# EAGLE design Router32PA v1 (EAGLE 9.5.0)
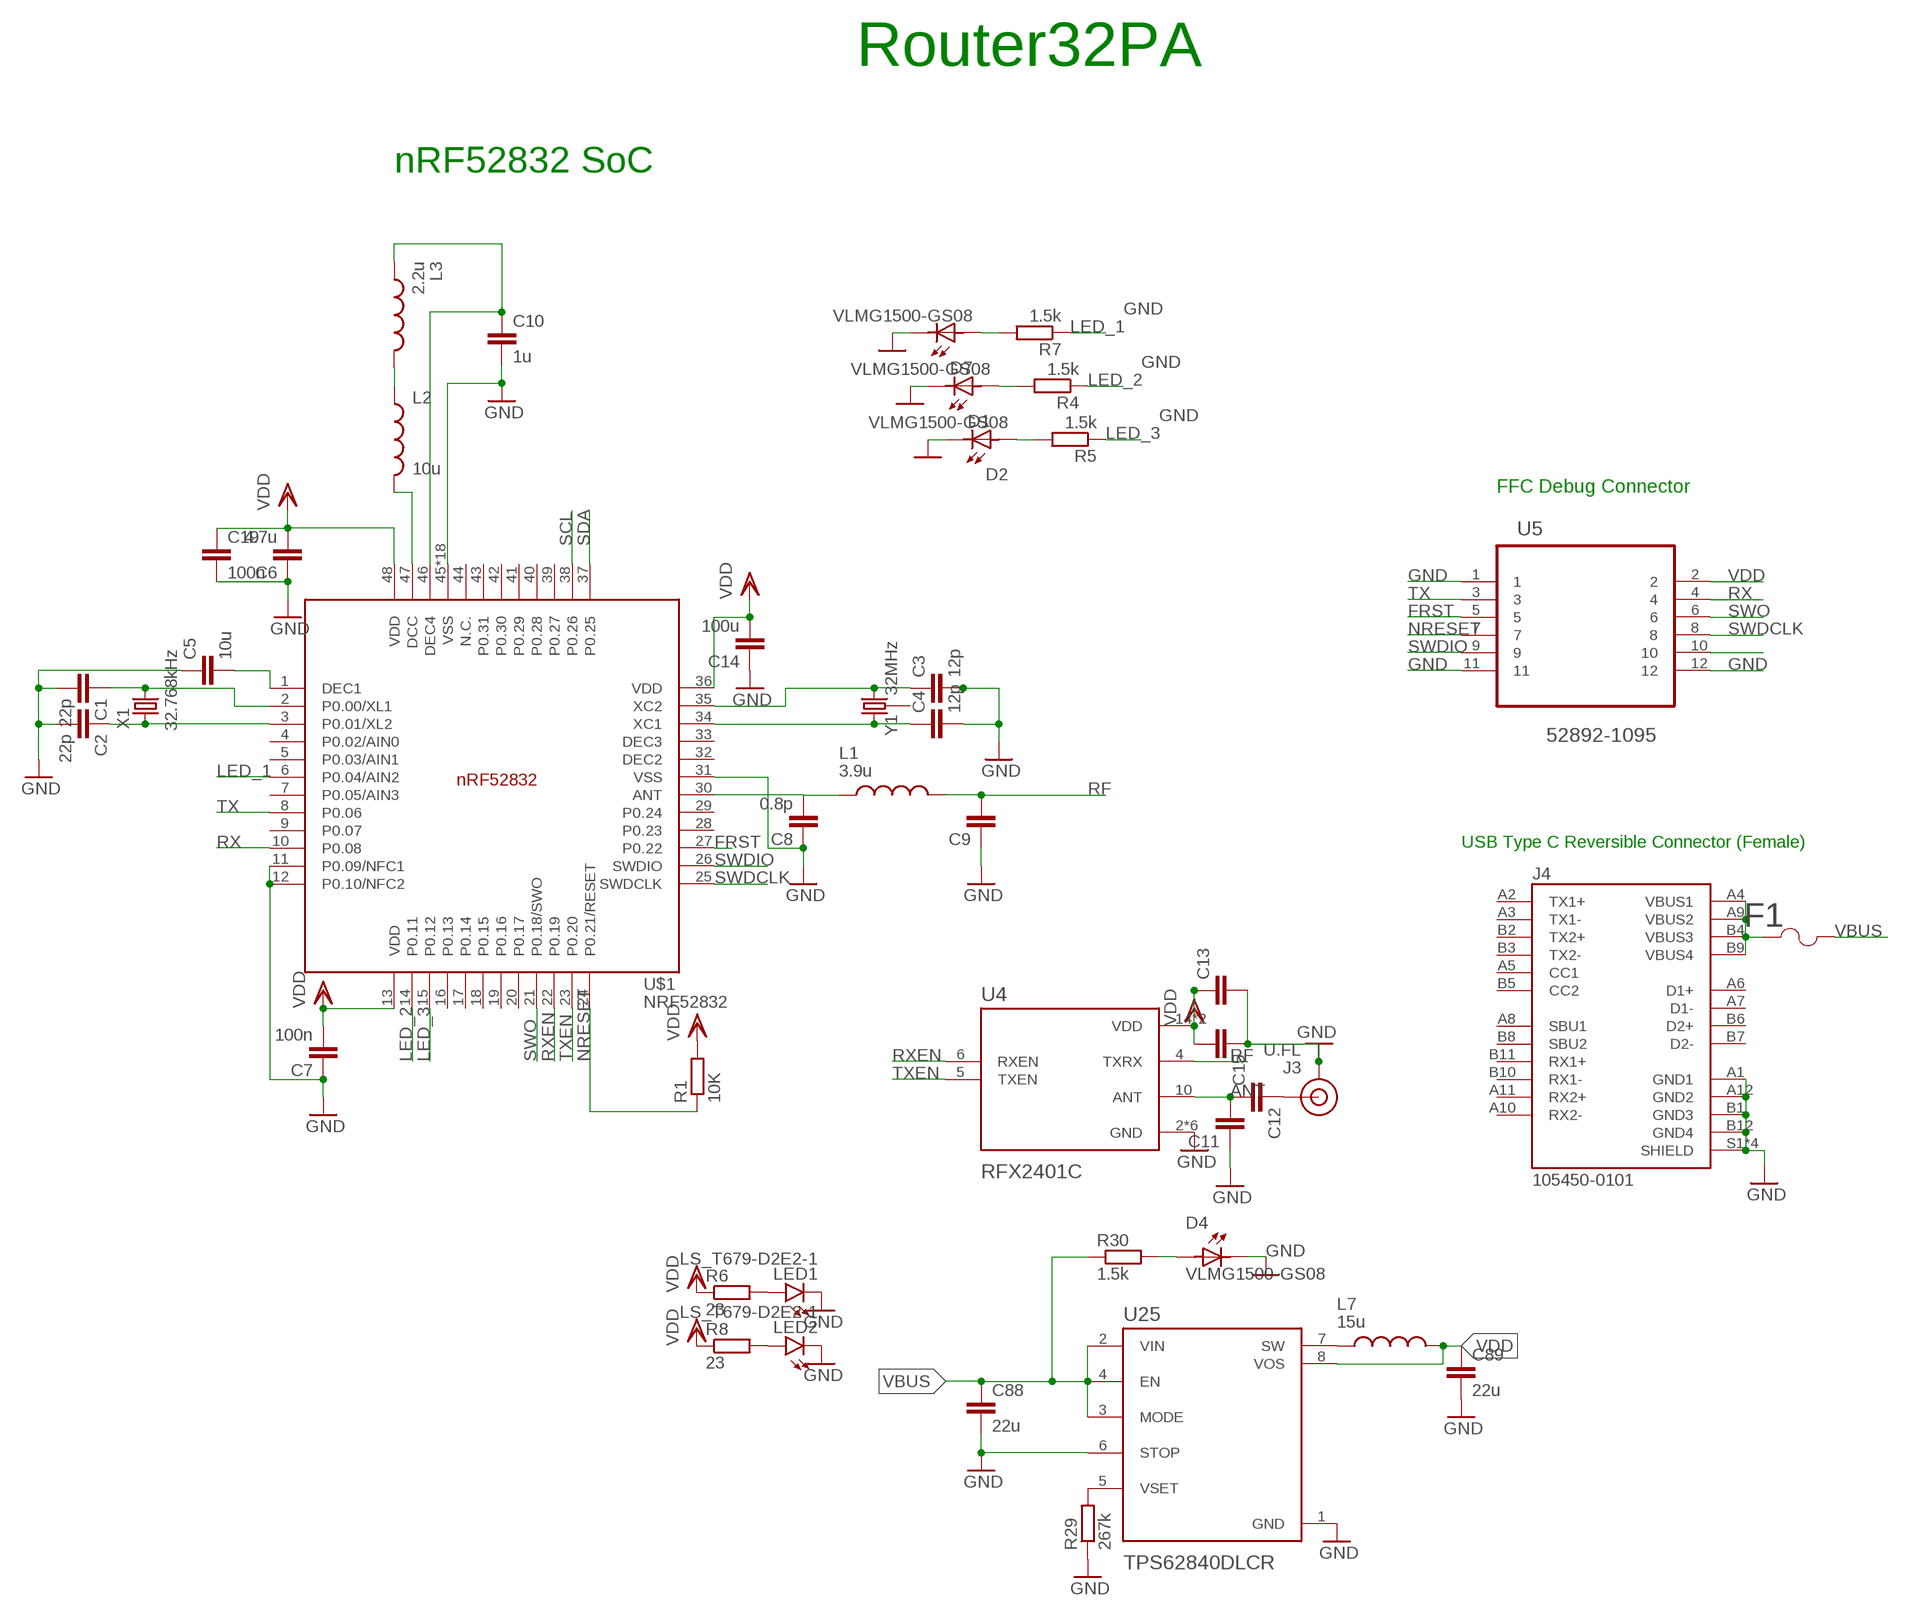
[diagram p0: schematic, sheet 1]

## Parts
C1  22p  CC0402  [C0402]
C2  22p  CC0402  [C0402]
C3  12p  CC0402  [C0402]
C4  12p  CC0402  [C0402]
C5  10u  CC0402  [C0402]
C6  4.7u  CC0402  [C0402]
C7  100n  CC0603R  [C0603R]
C8  0.8p  CC0402  [C0402]
C9  1.2p  CC0402  [C0402]
C10  1u  CC0402  [C0402]
C11  1.2p  CC0402  [C0402]
C12  1.2p  CC0402  [C0402]
C13  1.2p  CC0402  [C0402]
C14  100u  CC0402  [C0402]
C15  1.2p  CC0402  [C0402]
C19  100n  CC0402  [C0402]
C88  22u  CC0603R  [C0603R]
C89  22u  CC0603R  [C0603R]
D1  VLMG1500-GS08  [LEDC1005X35N]
D2  VLMG1500-GS08  [LEDC1005X35N]
D4  VLMG1500-GS08  [LEDC1005X35N]
D7  VLMG1500-GS08  [LEDC1005X35N]
F1  1210L050YR1210LSERIES_LTF-L  [1210LSERIES_LTF-L]
J3  U.FL  U.FL2PIN  [U.FL]
J4  105450-0101  [MOLEX_105450-0101]
L1  3.9u  MHQ0402P7N5JT000  [INDC0402X26N]
L2  10u  INDUCTOR  [L0603]
L3  2.2u  MHQ0402P7N5JT000  [INDC0402X26N]
L7  15u  1277AS-H-1R5M=P2  [INDC3225X120N]
LED1  LS_T679-D2E2-1  [PLCC2]
LED2  LS_T679-D2E2-1  [PLCC2]
R1  10K  RR0402  [R0402]
R4  1.5k  RR0402  [R0402]
R5  1.5k  RR0402  [R0402]
R6  23  RR0402  [R0402]
R7  1.5k  RR0402  [R0402]
R8  23  RR0402  [R0402]
R29  267k  RR0402  [R0402]
R30  1.5k  RR0402  [R0402]
U4  RFX2401C  [QFN50P300X300X60-17N]
U5  52892-1095  [MOLEX_52892-1095]
U25  TPS62840DLCR  [SON50P200X150X100-8N]
U$1  NRF52832  [QFN40P600X600X90-48_N]
X1  32.768kHz  ABS07-32.768KHZ-T  [ABS07-32.768KHZ-T]
Y1  32MHz  CRYSTAL-26MHZSMD-3.2X2.5  [CRYSTAL-SMD-3.2X2.5MM]

## Nets
ANT: C11.2 C12.2 U4.10(ANT)
FRST: U5.5 U$1.27(P0.22)
GND: C1.2 C2.2 C3.2 C4.2 C5.1 C6.1 C7.1 C8.1 C9.1 C10.2 C11.1 C13.2 C14.1 C15.1 C19.2 C88.2 C89.2 D1.2 D2.2 D4.2 D7.2 J3.1(GND) J3.2(GND) J4.A1(GND1) J4.A12(GND2) J4.B1(GND3) J4.B12(GND4) J4.S1(SHIELD) J4.S2(SHIELD) J4.S3(SHIELD) J4.S4(SHIELD) LED1.C LED2.C R29.1 U4.2(GND) U4.3(GND) U4.8(GND) U4.9(GND) U4.11(GND) U4.17(GND) U5.1 U5.11 U5.12 U25.1(GND) U25.6(STOP) U$1.11(P0.09/NFC1) U$1.12(P0.10/NFC2) U$1.31(VSS) U$1.45(VSS) U$1.PAD(VSS) U$1.PAD@VIA01(VSS) U$1.PAD@VIA02(VSS) U$1.PAD@VIA03(VSS) U$1.PAD@VIA04(VSS) U$1.PAD@VIA05(VSS) U$1.PAD@VIA06(VSS) U$1.PAD@VIA07(VSS) U$1.PAD@VIA08(VSS) U$1.PAD@VIA09(VSS) U$1.PAD@VIA10(VSS) U$1.PAD@VIA11(VSS) U$1.PAD@VIA12(VSS) U$1.PAD@VIA13(VSS) U$1.PAD@VIA14(VSS) U$1.PAD@VIA15(VSS) U$1.PAD@VIA16(VSS)
LED_1: R7.1 U$1.6(P0.04/AIN2)
LED_2: R4.1 U$1.14(P0.11)
LED_3: R5.1 U$1.15(P0.12)
N$1: C1.1 U$1.2(P0.00/XL1) X1.2
N$2: C2.1 U$1.3(P0.01/XL2) X1.1
N$3: C3.1 U$1.35(XC2) Y1.3
N$4: C4.1 U$1.34(XC1) Y1.1
N$5: C5.2 U$1.1(DEC1)
N$6: C8.2 L1.1 U$1.30(ANT)
N$7: D1.1 R4.2
N$8: D2.1 R5.2
N$9: L2.2 U$1.47(DCC)
N$10: L2.1 L3.2
N$11: C10.1 L3.1 U$1.46(DEC4)
N$12: F1.1 J4.A4(VBUS1) J4.A9(VBUS2) J4.B4(VBUS3) J4.B9(VBUS4)
N$13: LED1.A R6.2
N$14: LED2.A R8.2
N$15: C12.1 J3.FEED(SIGNAL)
N$19: D7.1 R7.2
N$21: U5.10
N$80: L7.1 U25.7(SW)
N$81: R29.2 U25.5(VSET)
N$84: D4.1 R30.2
NRESET: R1.1 U5.7 U$1.24(P0.21/RESET)
RF: C9.2 L1.2 U4.4(TXRX)
RX: U5.4 U$1.10(P0.08)
RXEN: U4.6(RXEN) U$1.22(P0.19)
SCL: U$1.38(P0.26)
SDA: U$1.37(P0.25)
SWDCLK: U5.8 U$1.25(SWDCLK)
SWDIO: U5.9 U$1.26(SWDIO)
SWO: U5.6 U$1.21(P0.18/SWO)
TX: U5.3 U$1.8(P0.06)
TXEN: U4.5(TXEN) U$1.23(P0.20)
VBUS: C88.1 F1.2 R30.1 U25.2(VIN) U25.3(MODE) U25.4(EN)
VDD: C6.2 C7.2 C13.1 C14.2 C15.2 C19.1 C89.1 L7.2 R1.2 R6.1 R8.1 U4.14(VDD) U4.16(VDD) U5.2 U25.8(VOS) U$1.13(VDD) U$1.36(VDD) U$1.48(VDD)
Unconnected: J4.A2(TX1+) J4.A3(TX1-) J4.A5(CC1) J4.A6(D1+) J4.A7(D1-) J4.A8(SBU1) J4.A10(RX2-) J4.A11(RX2+) J4.B2(TX2+) J4.B3(TX2-) J4.B5(CC2) J4.B6(D2+) J4.B7(D2-) J4.B8(SBU2) J4.B10(RX1-) J4.B11(RX1+) U$1.4(P0.02/AIN0) U$1.5(P0.03/AIN1) U$1.7(P0.05/AIN3) U$1.9(P0.07) U$1.16(P0.13) U$1.17(P0.14) U$1.18(P0.15) U$1.19(P0.16) U$1.20(P0.17) U$1.28(P0.23) U$1.29(P0.24) U$1.32(DEC2) U$1.33(DEC3) U$1.39(P0.27) U$1.40(P0.28) U$1.41(P0.29) U$1.42(P0.30) U$1.43(P0.31) U$1.44(N.C.) Y1.2 Y1.4

## Notes on the sheet
- Router32PA
- nRF52832 SoC
- FFC Debug Connector
- USB Type C Reversible Connector (Female)

## Library data of the parts
C1-C6 C8-C15 C19 = eagle-ltspice:C: CAPACITOR, European symbol; SPICEMODEL: NONE; SPICEPREFIX: C
C7 C88 C89 = eagle-ltspice:C: CAPACITOR, European symbol
D1 D2 D4 D7 = VLMG1500-GS08:VLMG1500-GS08: 0402 GREEN 571nm 35MCD 65° Rectangle with Flat Top SMT LED; AVAILABILITY: Unavailable; DESCRIPTION: 0402 GREEN 571nm 35MCD 65° Rectangle with Flat Top SMT LED; MF: Vishay; MP: VLMG1500-GS08; PACKAGE: 0402 Vishay; PRICE: None
F1 = 1210 FUSE:1210L050YR; BUILT_BY: EMA_UL_Team; MANUFACTURER_PART_NUMBER: 1210L050YR; SOURCELIBRARY: LittleFuse_2015-04-13; VENDOR: Littelfuse Inc
J3 = SparkFun-Connectors:U.FL2PIN: SMD Antenna Connector - U.FL 2mm height, 3.0mm x 3.0mm receptacle size. SparkFun Products: SparkFun WiFi Shield - ESP8266 <https://www.sparkfun.com/products/13287> SparkFun ESP8266 Thing <https://www.sparkfun.com/products/13231> SparkFun MiniGen - Pro Mini Signal Generator Shield <https://www.sparkfun.com/products/11420>; PROD_ID: CONN-09193; SF_ID: WRL-09144
J4 = 105450-0101:105450-0101: USB Shielded I/O Receptacle; Type C; Right Angle; Surface Mount; Gold over Nickel; AVAILABILITY: Unavailable; DESCRIPTION: USB-C (USB TYPE-C) USB 3.1 (USB 3.1 Gen 2, Superspeed+) Receptacle Connector 24 Position Surface Mount, Right Angle; Through Hole; MF: Molex; MP: 1054500101; PACKAGE: None; PRICE: None
L1 L3 = MHQ0402P7N5JT000:MHQ0402P7N5JT000: 221 NH 5% GOLD TERMINAL; AVAILABILITY: Unavailable; DESCRIPTION: FIXED IND 7.5NH 200MA 1.2 OHM; MF: TDK; MP: MHQ0402P7N5JT000; PACKAGE: 0402 TDK; PRICE: None
L2 = BeagleBone_Blue_R3:INDUCTOR: Inductors Basic Inductor/Choke - 0603 and 1206. Footprints are not proven and vary greatly between part numbers. SRN6045- 33uH, 20% 1.4A
L7 = 1277AS-H-1R5M_P2:1277AS-H-1R5M=P2: Ind Metal Alloy Shielded 1.5uH 20% 1MHz Powdered Iron 2.6A 1210 T/R Check prices <https://pricing.snapeda.com/parts/1277AS-H-1R5M%3DP2/Murata/view-part?ref=eda>; AVAILABILITY: Warning; DESCRIPTION: Inductor with Inductance: 1.5uH Tol. +/-20%, Package: 1210 (3225); MF: Murata; MP: 1277AS-H-1R5M=P2; PACKAGE: 1210 Murata; PRICE: None; PURCHASE-URL: https://pricing.snapeda.com/search/part/1277AS-H-1R5M=P2/?ref=eda
LED1 LED2 = led:*_T679-?-1: LC TOPLED® Low Current LED Source: http://catalog.osram-os.com .. LG_LS_LY_T679_OBS.pdf; COLOR: super-red
R1 R4-R8 R29 R30 = eagle-ltspice:R: RESISTOR, European symbol; SPICEMODEL: NONE; SPICEPREFIX: R
U4 = RFX2401C:RFX2401C: None Check prices <https://pricing.snapeda.com/parts/RFX2401C/Skyworks%20Solutions/view-part?ref=eda>; AVAILABILITY: Warning; DESCRIPTION: RF Front End 2.4GHz ~ 2.5GHz 802.15.4, Zigbee® 16-QFN (3x3); MF: Skyworks Solutions; MP: RFX2401C; PACKAGE: UFQFN-16 Skyworks Solutions; PRICE: None; PURCHASE-URL: https://pricing.snapeda.com/search/part/RFX2401C/?ref=eda
U5 = 52892-1095:52892-1095: CONNECTOR, FPC, ZIF, 0.50MM, 10 WAY; AVAILABILITY: Unavailable; DESCRIPTION: Socket, r/a, Fpc, Zif, Smt, 10way; MF: Molex; MP: 52892-1095; PACKAGE: None; PRICE: None
U25 = TPS62840DLCR:TPS62840DLCR: None Check prices <https://snapeda.com/parts/TPS62840DLCR/Texas%20Instruments/view-part/?ref=eda> Check prices <https://pricing.snapeda.com/parts/TPS62840DLCR/Texas%20Instruments/view-part?ref=eda>; AVAILABILITY: Warning; DESCRIPTION: 60-nA IQ, 1.8-V to 6.5-VIN, high-efficiency 750-mA step-down converter 8-VSON-HR -40 to 125; MF: Texas Instruments; MP: TPS62840DLCR; PACKAGE: VSON-HR-8 Texas Instruments; PRICE: None; PURCHASE-URL: https://pricing.snapeda.com/search/part/TPS62840DLCR/?ref=eda
U$1 = Nordic_nRF:NRF52832: nRF52832 Features Single chip, highly flexible, 2.4 GHz multi-protocol SoC 32-bit ARM Cortex-M4F Processor 1.7v to 3.6v operation 512kB flash + 64kB RAM Supports concurrent Bluetooth Smart/ANT protocol operation On-chip NFC tag for Out-of-Band (OOB) pairing Up to +4dBm output power -96dBm sensitivity, Bluetooth Smart Thread safe and run-time protected Event driven API On air compatible with nRF24L and nRF24AP series 2 data rates (2Mbps/1Mbps) PPI - maximum flexibility for power-efficient applications and code simplification Automated power management system with automatic power management of each peripheral Configurable I/O mapping for analog and digital I/O 3 x Master/Slave SPI 2 x Two-wire interface (I²C) UART (RTS/CTS) 3 x PWM AES HW encryption Real Time Counter (RTC) Digital microphone interface (PDM) On-chip balun Applications Internet of Things (IoT) Wearables SmartHome sensors Connected white goods Computer peripherals Voice-command smart remotes A4WP ‘Rezence’ wireless charging Beacons Sports and fitness sensors and hubs Connected health products Smart watches RC Toys Interactive games Building automation and sensor networks
X1 = Crystals:ABS07-32.768KHZ-T: CRYSTAL 32.7680KHZ 12.5PF SMD Manufacturer's datasheet <https://abracon.com/Resonators/ABS07.pdf>; CREATED_BY: PCBLayout.com; DIGIKEY_PART_NUMBER: 535-9542-2-ND; MANUFACTURER: Abracon LLC; MPN: ABS07-32.768KHZ-T; PACKAGE: SMD-2
Y1 = SparkFun-Clocks:CRYSTAL-26MHZ: 26MHz Crystal w/ Ground Pin Digikey Example <http://www.digikey.com/product-detail/en/epson/TSX-3225%2026.0000MF09Z-AC3/SER3627CT-ND/1802878> Frequency: 26MHz Frequency Stability: ±9ppm Frequency Tolerance: ±10ppm Load Capacitance: 9pF SparkFun Products: SparkFun ESP32 Thing <https://www.sparkfun.com/products/13907> SparkFun ESP8266 Thing Dev Board <https://www.sparkfun.com/products/13711>; PROD_ID: XTAL-12454

## Net classes
1 RF: clearance 0.4 mm

## Board
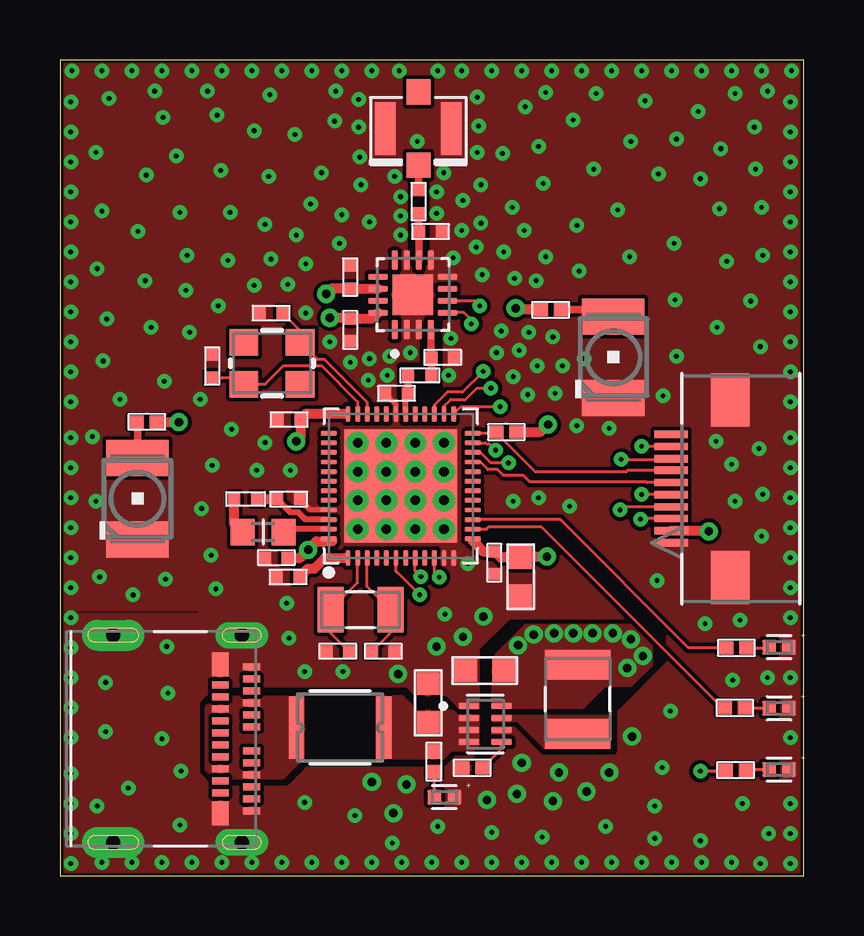
[diagram p1: board, top side]
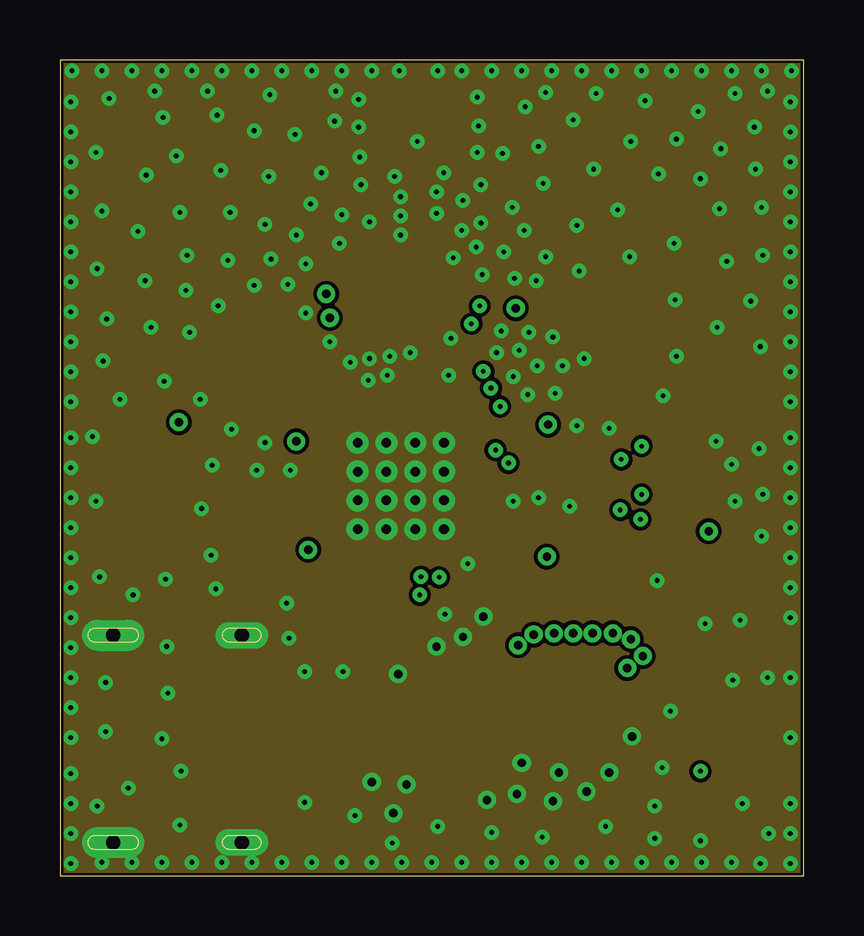
[diagram p2: board, inner layer GND]
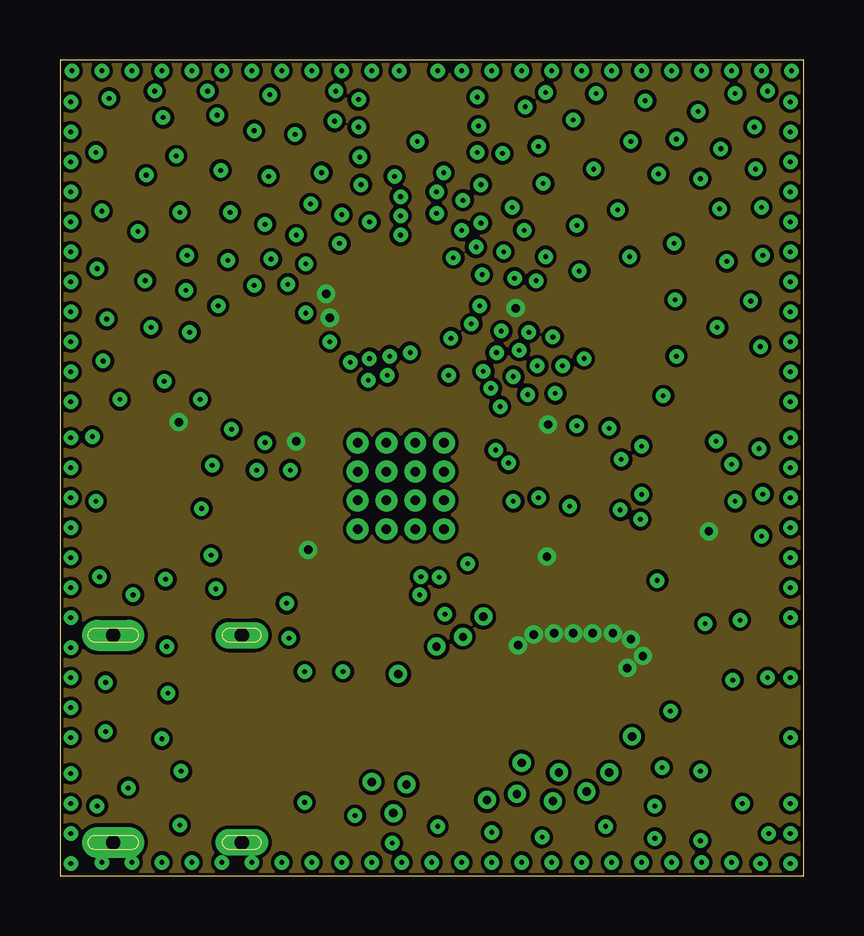
[diagram p3: board, inner layer VDD]
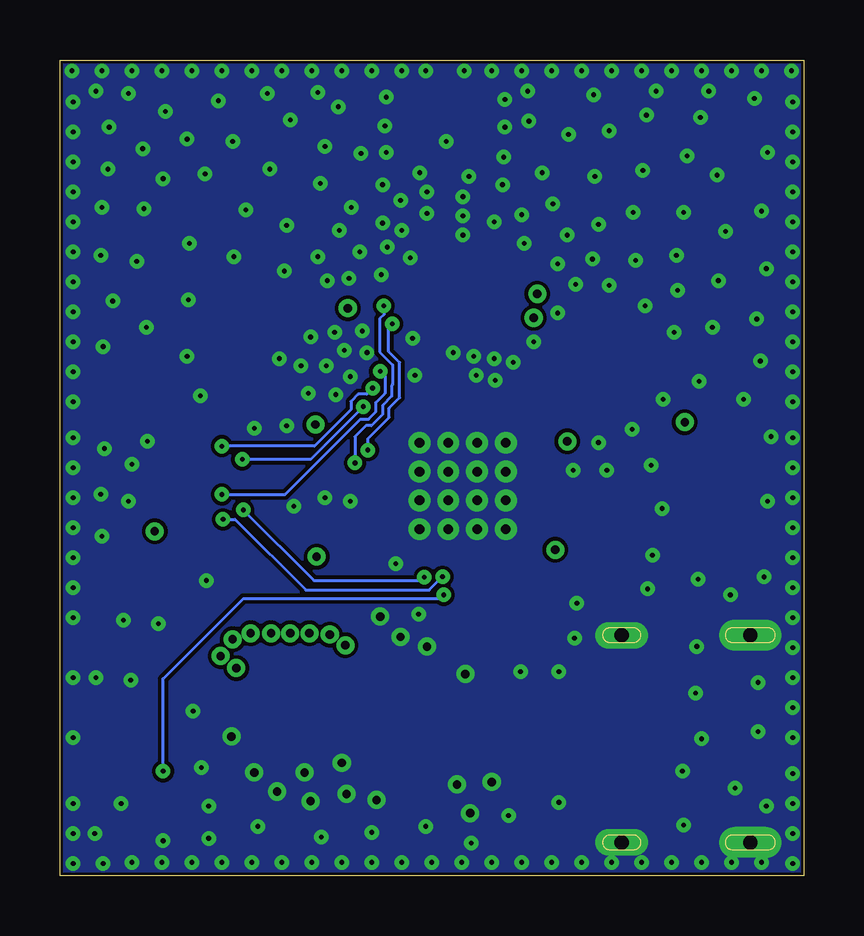
[diagram p4: board, bottom side, seen from below]

Size 31 x 34 mm. Coordinates in mm from the lower left corner, seen from the top.
Outline: 0,0 31,0 31,34 0,34 0,0
Copper layers (1+2*15+16): Top 0.035mm / dielectric 0.2mm / GND 0.035mm / dielectric 0.45mm / VDD 0.035mm / dielectric 0.2mm / Bottom 0.035mm
Design rules "default *": minimum track width 5mil, minimum drill 0.2mm, track to track 6mil, track to pad 6mil, pad to pad 6mil, via to via 6mil, smd to smd 6mil, copper to edge 5mil, drill to drill 6mil, minimum pad ring 10mil, minimum via ring 8mil, stop-mask expansion 0mil, vias tented up to drill 40mil, thermal gap 0mil
tRestrict: 9 lines

### Footprints (pad centres in the part's own frame; a part is rotated, then mirrored left to right if it is on the bottom)
C0402 = smd 0.5 x 0.5: 1 -0.475,0; 2 0.475,0
C0603R = smd 0.95 x 0.95: 1 -0.85,0; 2 0.75,0
LEDC1005X35N = smd 0.59 x 0.61: 1 -0.415,0; 2 0.415,0
1210LSERIES_LTF-L = smd 0.635 x 2.591: 1 -1.816,0; 2 1.816,0
U.FL = smd 2.2 x 0.85: 1 0,1.375; 2 0,-1.375 | smd 1.05 x 1: FEED 1.525,0; NC -1.525,0
MOLEX_105450-0101 = smd 0.3 x 0.7: A1 -3,3.77; A2 -2.5,3.77; A3 -2,3.77; A4 -1.5,3.77; A5 -1,3.77; A6 -0.5,3.77; A7 0.5,3.77; A8 1,3.77; A9 1.5,3.77; A10 2,3.77; A11 2.5,3.77; A12 3,3.77; B2 2.25,2.47; B3 1.75,2.47; B4 1.25,2.47; B5 0.75,2.47; B6 0.25,2.47; B7 -0.25,2.47; B8 -0.75,2.47; B9 -1.25,2.47; B10 -1.75,2.47; B11 -2.25,2.47 | smd 1 x 0.7: B1 3.1,2.47; B12 -3.1,2.47 | drill 0.6 pad 1.1 long: S1 -4.32,3.36; S2 4.32,3.36 | drill 0.6 pad 1.3 long: S3 -4.32,-2; S4 4.32,-2
INDC0402X26N = smd 0.5 x 0.5: 1 -0.732,0; 2 0.232,0
L0603 = smd 1 x 1.1: 1 -0.85,0; 2 0.85,0
INDC3225X120N = smd 1.24 x 2.72: 1 -1.44,0; 2 1.44,0
PLCC2 = smd 2.6 x 1.5: A 0,1.7; C 0,-1.7
R0402 = smd 0.6 x 0.55: 1 -0.425,0; 2 0.425,0
QFN50P300X300X60-17N = smd 0.81 x 0.27: 1 -1.445,0.75; 2 -1.445,0.25; 3 -1.445,-0.25; 4 -1.445,-0.75; 9 1.445,-0.75; 10 1.445,-0.25; 11 1.445,0.25; 12 1.445,0.75 | smd 0.27 x 0.81: 5 -0.75,-1.445; 6 -0.25,-1.445; 7 0.25,-1.445; 8 0.75,-1.445; 13 0.75,1.445; 14 0.25,1.445; 15 -0.25,1.445; 16 -0.75,1.445 | smd 1.7 x 1.7: 17 0,0
MOLEX_52892-1095 = smd 0.305 x 1.397: 1 2.261,2.896; 2 1.753,2.896; 3 1.245,2.896; 4 0.762,2.896; 5 0.254,2.896; 6 -0.254,2.896; 7 -0.762,2.896; 8 -1.245,2.896; 9 -1.753,2.896; 10 -2.261,2.896 | smd 2.21 x 1.6: 11 -3.702,5.359; 12 3.702,5.359
SON50P200X150X100-8N = smd 0.86 x 0.27: 1 -0.685,0.75; 2 -0.685,0.25; 3 -0.685,-0.25; 4 -0.685,-0.75; 5 0.685,-0.75; 6 0.685,-0.25; 7 0.685,0.25; 8 0.685,0.75
QFN40P600X600X90-48_N = smd 0.65 x 0.2: 1 -3,2.2; 2 -3,1.8; 3 -3,1.4; 4 -3,1; 5 -3,0.6; 6 -3,0.2; 7 -3,-0.2; 8 -3,-0.6; 9 -3,-1; 10 -3,-1.4; 11 -3,-1.8; 12 -3,-2.2; 25 3,-2.2; 26 3,-1.8; 27 3,-1.4; 28 3,-1; 29 3,-0.6; 30 3,-0.2; 31 3,0.2; 32 3,0.6; 33 3,1; 34 3,1.4; 35 3,1.8; 36 3,2.2 | smd 0.2 x 0.65: 13 -2.2,-3; 14 -1.8,-3; 15 -1.4,-3; 16 -1,-3; 17 -0.6,-3; 18 -0.2,-3; 19 0.2,-3; 20 0.6,-3; 21 1,-3; 22 1.4,-3; 23 1.8,-3; 24 2.2,-3; 37 2.2,3; 38 1.8,3; 39 1.4,3; 40 1,3; 41 0.6,3; 42 0.2,3; 43 -0.2,3; 44 -0.6,3; 45 -1,3; 46 -1.4,3; 47 -1.8,3; 48 -2.2,3 | smd 4.7 x 4.7: PAD 0,0 | drill 0.4: PAD@VIA01 -1.8,1.8; PAD@VIA02 -1.8,0.6; PAD@VIA03 -1.8,-0.6; PAD@VIA04 -1.8,-1.8; PAD@VIA05 -0.6,1.8; PAD@VIA06 -0.6,0.6; PAD@VIA07 -0.6,-0.6; PAD@VIA08 -0.6,-1.8; PAD@VIA09 0.6,1.8; PAD@VIA10 0.6,0.6; PAD@VIA11 0.6,-0.6; PAD@VIA12 0.6,-1.8; PAD@VIA13 1.8,1.8; PAD@VIA14 1.8,0.6; PAD@VIA15 1.8,-0.6; PAD@VIA16 1.8,-1.8
ABS07-32.768KHZ-T = smd 1.1 x 1.9: 1 -1.25,0; 2 1.25,0
CRYSTAL-SMD-3.2X2.5MM = smd 1.2 x 1.1: 1 -1.175,-0.875; 2 1.175,-0.875; 3 1.175,0.875; 4 -1.175,0.875

### Placement (x,y rotation side)
C1  11.58,9.35 180 top
C2  13.48,9.35 0 top
C3  6.35,21.24 90 top
C4  8.8,23.45 180 top
C5  9.51,12.45 0 top
C6  9.02,13.25 0 top
C7  17.76,8.55 0 top
C8  14.03,20.1 0 top
C9  15.96,21.6 180 top
C10  9.53,15.69 0 top
C11  15.45,26.85 180 top
C12  14.95,28.1 270 top
C13  12.1,22.75 270 top
C14  18.11,13.04 90 top
C15  12.1,24.95 270 top
C19  9.55,19.01 180 top
C88  15.35,7.25 90 top
C89  19.2,12.41 270 top
D1  29.98,6.97 0 top
D2  29.98,9.52 0 top
D4  16.03,3.27 0 top
D7  29.98,4.42 0 top
F1  11.68,6.17 0 top
J3  14.94,31.14 270 top
J4  4.22,5.7 270 top
L1  15.25,20.85 0 top
L2  8.47,14.32 0 top
L3  7.49,15.7 180 top
L7  21.58,7.35 90 top
LED1  23.07,21.61 0 top
LED2  3.23,15.71 0 top
R1  18.61,18.49 0 top
R4  28.14,6.99 0 top
R5  28.2,9.49 0 top
R6  20.46,23.59 0 top
R7  28.17,4.39 0 top
R8  3.62,18.91 180 top
R29  17.19,4.49 0 top
R30  15.59,4.75 270 top
U4  14.71,24.21 90 top
U5  22.58,16.13 270 top
U25  17.73,6.32 0 top
U$1  14.21,16.24 90 top
X1  12.53,11.08 180 top
Y1  8.84,21.36 180 top

### Tracks (layer width: path | path; a pad name or v marks a point on that pad's centre or on a via)
ANT
  Top 0.305: U4.10 14.96,26.84 C11.2 14.95,26.88 C12.2
FRST  (via drill 0.2)
  Top 0.127: U5.5 24.26,15.88 v24.25,15.89 | v17.65,21.02 16.78,20.15 16.15,20.15 15.61,19.61 U$1.27
  Bottom 0.127: v24.25,15.89 21.62,15.89 18.47,19.03 18.14,19.03 17.83,19.34 17.83,19.72 17.45,20.1 17.45,20.82 v17.65,21.02
GND  (via drill 0.2, 0.35)
  Top 0.203: U$1.45 10.46,15.24 C10.2 | U$1.31 14.01,19.64 C8.1
  other vias: 19.05,3.4 13,3.9 19.25,4.7 17.8,3.15 20.55,3.1 17.65,10.8 23.85,5.8 16.8,9.95 14.1,8.4 15.7,9.55 20.8,4.3 22.9,4.3 21.95,3.5 13.9,2.6 14.45,3.8 13.65,20.85 14.6,21.8 12.85,20.65 11.65,26.35 12.9,27.25 17.55,27.2 18.5,26 16.8,28.15 17.45,31.25 12.5,29.95 14.9,30.6 15.7,28.5 15.7,27.6 13.95,29.15 14.2,26.7 14.2,28.3 14.2,27.5 16.3,22.4 17.6,25.05 10.25,25.5 10.9,29.3 18.45,30.1 11.75,27.55 12.55,28.8 12.45,32.35 12.45,31.2 17.4,30.15 16,29.3 17.55,28.8 17.4,32.45 8.1,24.6 18.85,27.85 13.75,21.65 10.25,23.45 12.1,21.4 11.25,22.25 12.9,21.55 8.8,25.7 8.1,31.05 4.3,31.6 3.8,22.85 21.65,25.2 5,27.65 9.8,30.9 19.85,24.8 9.85,26.7 6.6,23.75 11.5,32.7 18.95,24.9 8.55,27.15 5.25,24.4 1.5,30.15 1.75,27.7 6.55,31.7 5.4,22.65 6.7,29.4 11.45,31.45 16.2,20.85 10.45,28 7.1,27.65 6.15,32.7 19.35,26.9 20.25,25.8 3.55,24.8 3.95,32.7 3.25,26.85 8.75,32.55 3.6,29.2 4.85,30 5.3,25.85 9.5,24.65 7,25.65 8.7,29.15 2.05,32.4 17.35,26.2 21.55,27.1 4.35,20.6 1.95,23.2 20.15,28.85 6.35,17.1 7.15,18.6 1.8,21.45 22.25,29.45 19.4,32.05 19.95,30.4 1.55,25.3 29.25,14.15 4.4,12.35 1.35,18.3 8.55,18.05 8.2,16.9 5.9,15.3 9.6,16.9 1.5,15.6 3.05,11.7 1.65,12.45 9.45,11.35 6.3,13.35 2.5,19.85 6.5,11.95 24.9,12.3 23.25,27.75 23.75,25.8 29.25,27.85 25.65,24 25.15,20 27.35,18.1 21.25,15.4 29.15,17.8 25.6,26.35 16.05,10.9 29.2,22.05 28.8,23.95 27.8,25.6 27.5,27.8 25.7,30.7 27.4,22.85 20.25,32.65 22.35,32.6 28.15,32.6 25.7,21.65 5,2.1 26.7,29.05 26.6,31.85 18.9,15.6 28.15,15.6 29,29.45 21.4,31.5 23.8,30.6 28,17.15 29.3,25.85 19.95,15.75 29.3,15.9 27.55,30.3 24.95,29.25 9.55,9.9 1.9,6 11.8,8.5 24.4,32.3 28.95,31.2 10.2,8.5 4.25,5.7 4.45,9.55 2.85,3.65 18,1.8 13.85,1.35 29.5,32.7 1.9,8.05 1.55,2.9 12.3,2.5 26.9,10.5 29.5,8.25 15.75,2.05 28.05,8.15 30.5,33.55 5.85,19.85 17,13 28.35,10.65 4.5,7.6 10.2,3.05 5.05,4.35 28.45,3 24.8,2.9 20.1,1.6 25.1,4.5 22.75,2.05 24.8,1.55 29.55,1.75 25.45,6.85 26.7,1.45 24.25,33.55 25.5,33.55 26.75,33.55 28,33.55 29.25,33.55 18,33.55 19.25,33.55 20.5,33.55 21.75,33.55 23,33.55 3,33.55 0.5,33.55 1.75,33.55 16.75,33.55 10.5,33.55 11.75,33.55 13,33.55 14.15,33.55 15.75,33.55 4.25,33.55 5.5,33.55 6.75,33.55 8,33.55 9.25,33.55 0.45,32.25 0.45,26 0.45,27.25 0.45,28.5 0.45,29.75 0.45,31 0.45,19.75 0.45,21 0.45,22.25 0.45,23.5 0.45,24.75 0.45,18.25 0.45,12 0.45,13.25 0.45,14.5 0.45,15.75 0.45,17 0.45,5.75 0.45,7 0.45,8.25 0.45,9.5 0.45,10.75 0.45,4.25 0.45,0.5 0.45,1.75 0.45,3 14.25,0.55 8,0.55 9.25,0.55 10.5,0.55 11.75,0.55 13,0.55 1.75,0.55 3,0.55 4.25,0.55 5.5,0.55 6.75,0.55 28,0.55 21.75,0.55 23,0.55 24.25,0.55 25.5,0.55 26.75,0.55 15.5,0.55 16.75,0.55 18,0.55 19.25,0.55 20.5,0.55 29.2,0.5 30.45,0.5 30.45,1.75 30.45,3 30.45,18.25 30.45,12 30.45,13.25 30.45,14.5 30.45,15.75 30.45,17 30.45,5.75 30.45,8.25 30.45,10.75 30.45,32.25 30.45,26 30.45,27.25 30.45,28.5 30.45,29.75 30.45,31 30.45,19.75 30.45,21 30.45,22.25 30.45,23.5 30.45,24.75 21.55,18.75 22.9,18.65 20.65,20.1 19.5,20.05 18.9,20.8 19.9,21.25 20.95,21.25 21.85,21.55 20.55,22.45 18.4,22.7 19.55,22.65 18.2,21.8 19.15,21.9 16.75,26.9 16.4,25.75
  pour GND: 0.05,34 31,34 31,0.05 0,0.05 0,33.95
  pour Top: 18.05,6.15 18.95,6.15 20.1,5 23.15,5 23.3,5.15 23.3,6.85 25.35,8.9 25.35,11.1 31,11.1 31,0 0,0 0,10.9 6.1,10.9 6.1,7.55 5.75,7.2 5.75,4.3 6.35,3.7 9.5,3.7 10.3,4.5 16.05,4.5 16.5,4.95 17.45,4.95 18.05,5.55
  pour Top: 17.45,7 17.45,9.45 18.75,10.75 25.45,10.75 25.45,12.6 7.15,12.6 5.8,11.25 5.8,8.7 6.6,7.9 14.45,7.9 14.8,7.55 16.1,7.55 16.65,7
  pour Top: 0.05,11.05 0.05,34 31.1,34 31.1,11.05
  pour Bottom: 0.05,33.95 31,33.95 31,0 0,0 0,33.9
LED_1  (via drill 0.2)
  Top 0.127: R7.1 27.7,4.35 v26.7,4.35 | v15,11.7 14.05,12.65 14.01,12.69 U$1.6
  Bottom 0.127: v26.7,4.35 26.7,8.2 23.35,11.55 15.15,11.55 v15,11.7
LED_2
  Top 0.127: 27.57,6.84 R4.1 27.61,6.99 20.05,14.55 17.9,14.55 17.79,14.44 U$1.14
LED_3
  Top 0.127: 27.59,9.49 R5.1 26.2,9.49 20.86,14.84 U$1.15
N$1
  Top 0.127: C1.1 11.28,10.12 X1.2 12.41,12.21 U$1.2
N$2
  Top 0.127: C2.1 13.78,10.12 X1.1 12.81,12.05 U$1.3
N$3
  Top 0.127: U$1.35 12.41,19.74 10.9,21.25 9.33,21.25 8.56,20.48 Y1.3 7.38,20.77 C3.1
N$4
  Top 0.127: U$1.34 12.81,19.73 11.02,21.53 10.72,21.53 Y1.1 10.02,22.71 C4.1
N$5
  Top 0.127: 11.9,13.24 U$1.1
  Top 0.406: C5.2 10.33,12.79 10.61,12.79 11.05,13.24 11.9,13.24
N$6
  Top 0.254: C8.2 14.41,20 U$1.30
  Top 0.305: C8.2 14.51,20.84 L1.1
N$7
  Top 0.127: R4.2 29.55,6.99 D1.1
N$8
  Top 0.127: R5.2 29.54,9.49 D2.1
N$9
  Top 0.254: U$1.47 9.45,14.44 9.44,14.44
  Top 0.305: 9.44,14.44 L2.2
N$10
  Top 0.406: L2.1 7.26,14.68 L3.2
N$11
  Top 0.127: U$1.46 11.1,14.85
  Top 0.254: C10.1 9.6,15.15 9.94,15.15 10.24,14.85 11.1,14.85 U$1.46
  Top 0.406: L3.1 C10.1
N$12
  pour Top: 8.55,4.05 6.45,4.05 6.1,4.4 6.1,7.05 6.15,7.1 6.5,7.45 8.5,7.45 10.15,7.45 10.15,4.9 9.3,4.05
N$13
  Top 0.305: LED1.A 22.79,23.59 R6.2
N$14
  Top 0.305: LED2.A 3.23,18.88 R8.2
N$15
  Top 0.305: C12.1 J3.FEED
N$19
  Top 0.127: R7.2 28.62,4.42 D7.1
N$80
  pour Top: 18.05,6.45 18.05,6.65 22.95,6.65 22.95,5.35 20.15,5.35 19.05,6.45
N$81
  Top 0.127: R29.2 18.41,5.29 U25.5
N$84
  Top 0.127: D4.1 15.62,4.3 R30.2
NRESET
  Top 0.127: U$1.24 18.14,18.44 R1.1 18.18,18.46 19.81,16.83 23.61,16.83 23.68,16.89 U5.7
RF
  Top 0.305: L1.2 C9.2 15.46,21.62 U4.4
RX  (via drill 0.2)
  Top 0.127: U5.4 24.42,15.37 24.41,15.37 23.48,15.37 v23.36,15.24 | v15.81,12.44 15.61,12.63 U$1.10
  Bottom 0.127: v23.36,15.24 20.42,12.3 15.94,12.3 v15.81,12.44
RXEN  (via drill 0.2)
  Top 0.127: U4.6 17.29,23.96 v17.5,23.75 | U$1.22 17.23,17.66 17.51,17.66 17.96,17.2 v18.7,17.2
  Bottom 0.127: v18.7,17.2 18.7,18.3 18.25,18.75 18.02,18.75 17.55,19.22 17.55,19.6 17.17,19.99 17.17,20.42 17.13,20.46 17.13,21.29 17.67,21.82 17.67,23.21 17.5,23.38 v17.5,23.75
SWDCLK  (via drill 0.2)
  Top 0.127: U$1.25 16.72,19.55 v18.35,19.55 | v23.4,17.35 25.45,17.35 U5.8
  Bottom 0.127: v23.4,17.35 20.55,17.35 19.43,18.48 v18.35,19.55
SWDIO  (via drill 0.2)
  Top 0.127: U$1.26 15.99,19.26 15.99,19.54 16.3,19.85 16.91,19.85 17.38,20.32 v17.97,20.32 | v24.25,17.9 25.46,17.9 U5.9
  Bottom 0.127: v17.97,20.32 18.21,20.07 18.57,20.07 18.87,19.77 18.87,19.43 20.39,17.9 v24.25,17.9
SWO
  Top 0.127: U5.6 24.49,16.38 24.46,16.41 19.59,16.41 19.32,16.68 18.48,16.68 18.25,16.92 17.84,16.92 17.52,17.24 U$1.21
TX  (via drill 0.2)
  Top 0.127: U5.3 24.23,14.88 v24.2,14.85 | v15.05,12.46 14.81,12.7 U$1.8
  Bottom 0.127: v24.2,14.85 23.7,14.85 20.75,11.9 15.61,11.9 v15.05,12.46
TXEN  (via drill 0.2)
  Top 0.127: U$1.23 17.75,18.04 17.8,18 17.9,18 v18.16,17.74 | v17.15,23 17.15,23.15 16.84,23.46 U4.5
  Bottom 0.127: v18.16,17.74 18.16,18.21 17.27,19.1 17.27,19.49 16.84,19.92 16.84,21.39 17.3,21.85 17.3,22.85 v17.15,23
VBUS
  pour Top: 13.25,4.9 16,4.9 16.35,5.25 17.25,5.25 17.45,5.45 17.45,6.65 16.6,6.65 16.45,6.8 16.4,6.85 14.9,6.85 14.3,7.45 13.2,7.45 13.2,4.95
VDD  (via drill 0.35)
  Top 0.127: 11.36,13.93 11.25,14.04 U$1.48 11.1,13.93 11.05,13.93 | U$1.36 11.65,19.24 | 17.21,13.94 U$1.13
  Top 0.406: 11.36,13.93 11.05,13.93 10.68,13.93 9.99,13.25 C6.2 10,13.25 10.33,13.58 v10.35,13.58 | 17.21,13.94 17.64,13.52 C14.2 18.36,13.26 C89.1 19.24,13.3 v20.3,13.3 | 11.9,19.24 11.65,19.24 10.26,19.24 C19.1 10.03,18.27 v9.85,18.1 | U4.16 13.03,23.23 C13.1 12.07,23.25 v11.25,23.25 | U4.14 12.12,24.46 C15.2 11.32,24.48 v11.1,24.25 | R6.1 19.06,23.59 v19,23.65 | U5.2 27.02,14.38 v27.05,14.35 | R8.1 v4.94,18.91 v4.95,18.9 | R1.2 20.04,18.49 v20.35,18.8
  other vias: 19.1,9.6 19.75,10.05 20.6,10.1 21.4,10.1 22.2,10.1 23.05,10.1 23.8,9.85 24.3,9.15 23.65,8.65
  pour Top: 18.05,7 18.05,9.05 18.25,9.25 18.35,9.35 22.9,9.35 22.9,8.1 21.8,7
  pour Top: 18.2,9.25 19.4,10.45 24.6,10.45 24.65,10.4 24.65,8.75 23.8,7.9 19.25,7.9 18.2,8.95
  pour VDD: 0.2,34 31.15,34 31.15,0.05 0.15,0.05 0.15,33.95